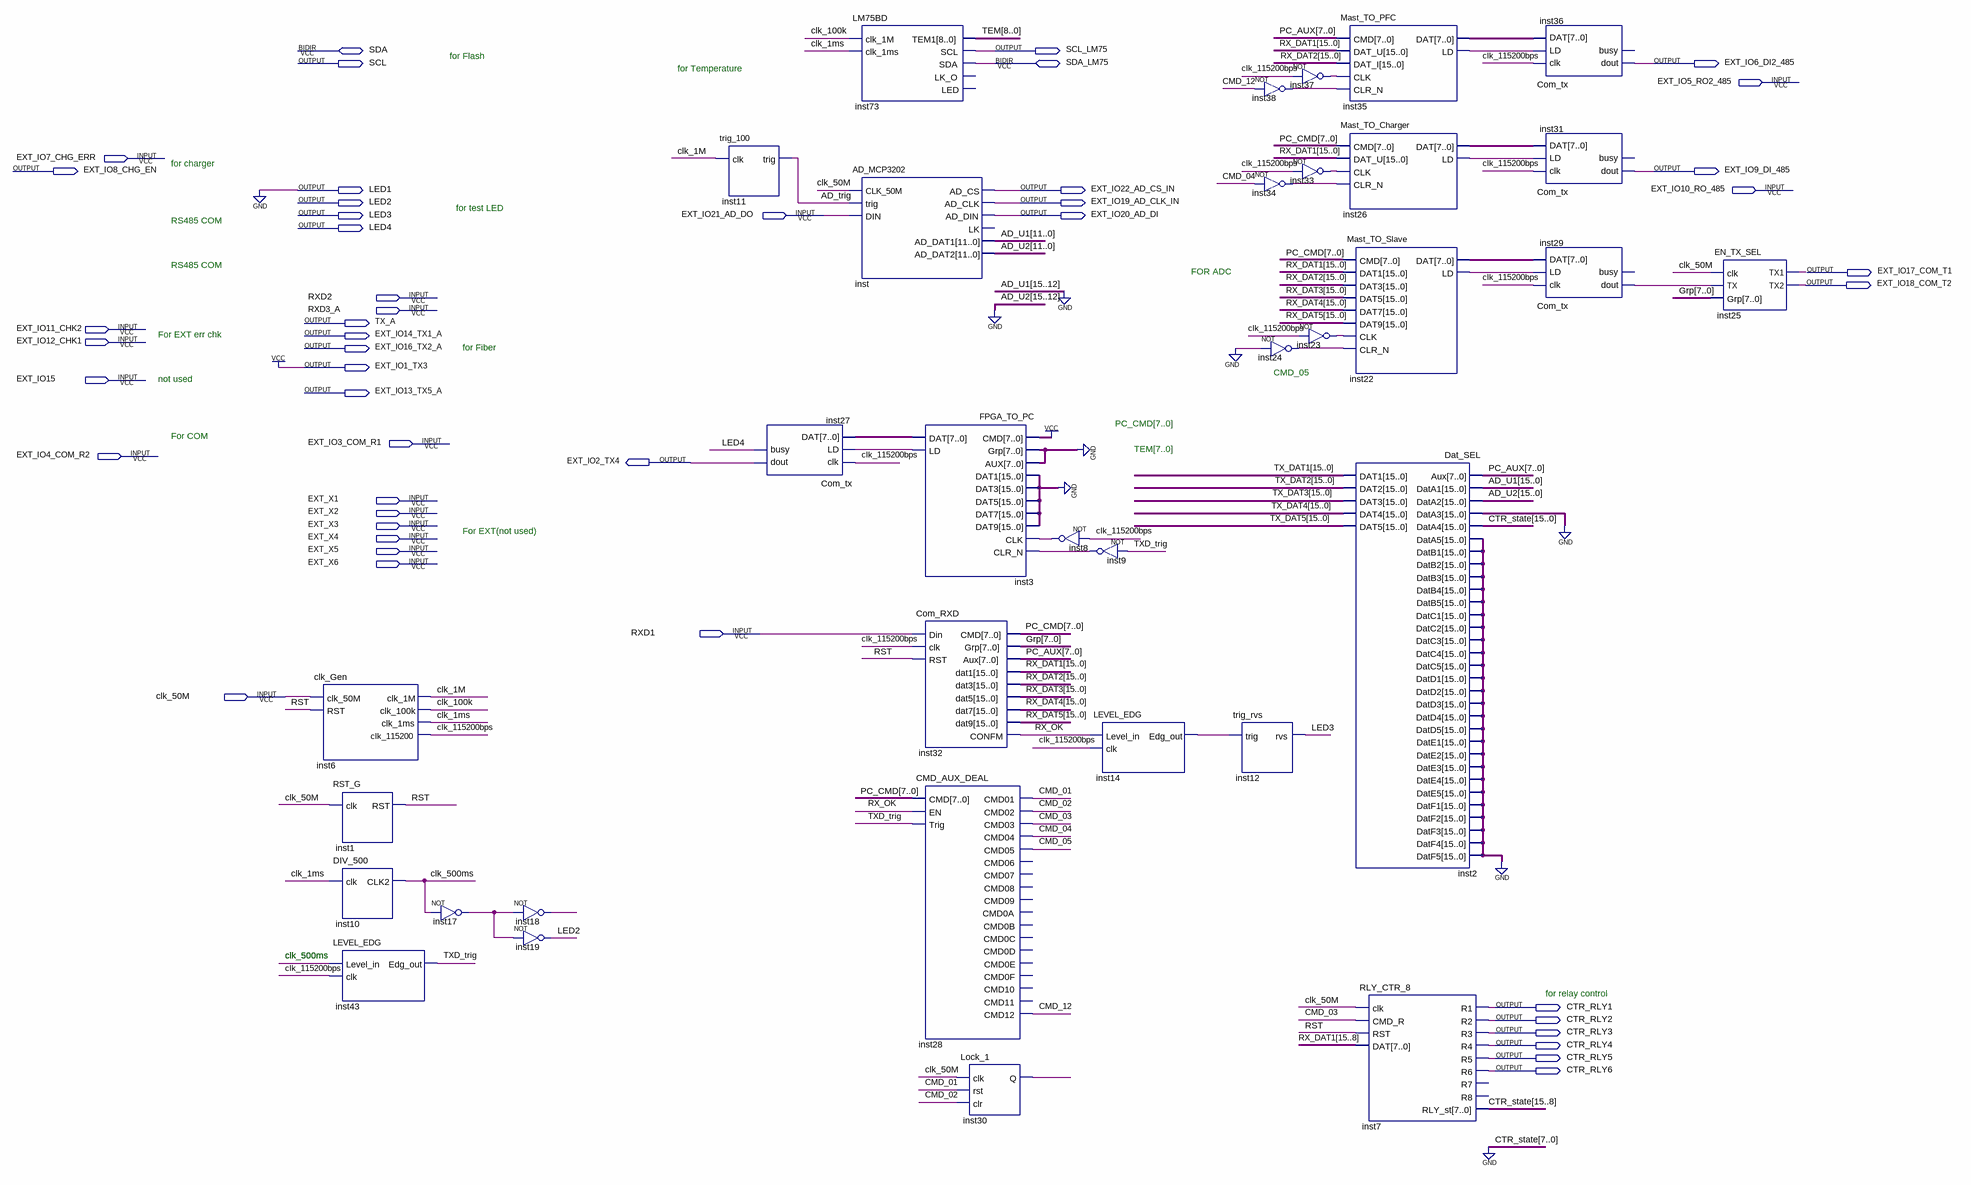
[diagram p0: schematic sheet]
// Quartus schematic TOP2.bdf as structural Verilog: 34 symbols, 47 pins
module TOP2 (
  input  EXT_IO5_RO2_485,
  input  EXT_IO7_CHG_ERR,
  input  EXT_IO10_RO_485,
  input  EXT_IO21_AD_DO,
  input  RXD2,
  input  RXD3_A,
  input  EXT_IO11_CHK2,
  input  EXT_IO12_CHK1,
  input  EXT_IO15,
  input  EXT_IO3_COM_R1,
  input  EXT_IO4_COM_R2,
  input  EXT_X1,
  input  EXT_X2,
  input  EXT_X3,
  input  EXT_X4,
  input  EXT_X5,
  input  EXT_X6,
  input  RXD1,
  input  clk_50M,
  inout  SDA,
  inout  SDA_LM75,
  output SCL_LM75,
  output SCL,
  output EXT_IO6_DI2_485,
  output EXT_IO8_CHG_EN,
  output EXT_IO9_DI_485,
  output LED1,
  output EXT_IO22_AD_CS_IN,
  output LED2,
  output EXT_IO19_AD_CLK_IN,
  output LED3,
  output EXT_IO20_AD_DI,
  output LED4,
  output EXT_IO17_COM_T1,
  output EXT_IO18_COM_T2,
  output TX_A,
  output EXT_IO14_TX1_A,
  output EXT_IO16_TX2_A,
  output EXT_IO1_TX3,
  output EXT_IO13_TX5_A,
  output EXT_IO2_TX4,
  output CTR_RLY1,
  output CTR_RLY2,
  output CTR_RLY3,
  output CTR_RLY4,
  output CTR_RLY5,
  output CTR_RLY6
);

  wire AD_trig, clk_1M, clk_1ms, clk_100k, clk_500ms, clk_115200bps, CMD_01, CMD_02, CMD_03, CMD_04, CMD_05,
       CMD_12, inst3_ld, inst8_out, inst9_out, inst14_edg_out, inst17_out, inst18_out, inst22_ld, inst23_out,
       inst24_out, inst26_ld, inst29_dout, inst30_q, inst33_out, inst34_out, inst35_ld, inst37_out,
       inst38_out, RST, RX_OK, TXD_trig;
  wire [7:0] Grp, inst3_dat, inst22_dat, inst26_dat, inst35_dat, PC_AUX, PC_CMD;
  wire [8:0] TEM;
  wire [11:0] AD_U1, AD_U2;
  wire [15:0] RX_DAT1, RX_DAT2, RX_DAT3, RX_DAT4, RX_DAT5, TX_DAT1, TX_DAT2, TX_DAT3, TX_DAT4, TX_DAT5;
  wire [15:8] CTR_state;

  clk_Gen inst6 (
    .clk_50M(clk_50M), .RST(RST), .clk_1M(clk_1M), .clk_100k(clk_100k), .clk_1ms(clk_1ms),
    .clk_115200(clk_115200bps));
  RST_G inst1 (.clk(clk_50M), .RST(RST));
  DIV_500 inst10 (.clk(clk_1ms), .CLK2(clk_500ms));
  LEVEL_EDG inst43 (.Level_in(clk_500ms), .clk(clk_115200bps), .Edg_out(TXD_trig));
  not inst17 (inst17_out, clk_500ms);
  not inst18 (inst18_out, inst17_out);
  not inst19 (LED2, inst17_out);
  trig_100 inst11 (.clk(clk_1M), .trig(AD_trig));
  Com_tx inst27 (.clk(clk_115200bps), .LD(inst3_ld), .DAT(inst3_dat), .dout(EXT_IO2_TX4), .busy(LED4));
  LM75BD inst73 (.clk_1M(clk_100k), .clk_1ms(clk_1ms), .TEM1(TEM), .SCL(SCL_LM75), .SDA(SDA_LM75));  // open: LK_O, LED
  AD_MCP3202 inst (
    .CLK_50M(clk_50M), .trig(AD_trig), .DIN(EXT_IO21_AD_DO), .AD_CS(EXT_IO22_AD_CS_IN),
    .AD_CLK(EXT_IO19_AD_CLK_IN), .AD_DIN(EXT_IO20_AD_DI), .AD_DAT1(AD_U1), .AD_DAT2(AD_U2));  // open: LK
  FPGA_TO_PC inst3 (
    .CMD({8{1'b1}}), .Grp({8{1'b0}}), .AUX({8{1'b0}}), .DAT1({16{1'b0}}), .DAT3({16{1'b0}}),
    .DAT5({16{1'b0}}), .DAT7({16{1'b0}}), .DAT9({16{1'b0}}), .CLK(inst8_out), .CLR_N(inst9_out),
    .DAT(inst3_dat), .LD(inst3_ld));
  Com_RXD inst32 (
    .Din(RXD1), .clk(clk_115200bps), .RST(RST), .CMD(PC_CMD), .Grp(Grp), .Aux(PC_AUX), .dat1(RX_DAT1),
    .dat3(RX_DAT2), .dat5(RX_DAT3), .dat7(RX_DAT4), .dat9(RX_DAT5), .CONFM(RX_OK));
  CMD_AUX_DEAL inst28 (
    .CMD(PC_CMD), .EN(RX_OK), .Trig(TXD_trig), .CMD01(CMD_01), .CMD02(CMD_02), .CMD03(CMD_03),
    .CMD04(CMD_04), .CMD05(CMD_05), .CMD12(CMD_12));  // open: CMD06, CMD07, CMD08, CMD09, CMD0A, CMD0B, CMD0C, CMD0D, CMD0E, CMD0F, CMD10, CMD11
  Lock_1 inst30 (.clk(clk_50M), .rst(CMD_01), .clr(CMD_02), .Q(inst30_q));
  not inst8 (inst8_out, clk_115200bps);
  not inst9 (inst9_out, TXD_trig);
  LEVEL_EDG inst14 (.Level_in(RX_OK), .clk(clk_115200bps), .Edg_out(inst14_edg_out));
  not inst38 (inst38_out, CMD_12);
  not inst34 (inst34_out, CMD_04);
  trig_rvs inst12 (.trig(inst14_edg_out), .rvs(LED3));
  not inst37 (inst37_out, clk_115200bps);
  not inst33 (inst33_out, clk_115200bps);
  not inst23 (inst23_out, clk_115200bps);
  not inst24 (inst24_out, 1'b0);
  Mast_TO_PFC inst35 (
    .CMD(PC_AUX), .DAT_U(RX_DAT1), .DAT_I(RX_DAT2), .CLK(inst37_out), .CLR_N(inst38_out), .DAT(inst35_dat),
    .LD(inst35_ld));
  Mast_TO_Charger inst26 (
    .CMD(PC_CMD), .DAT_U(RX_DAT1), .CLK(inst33_out), .CLR_N(inst34_out), .DAT(inst26_dat), .LD(inst26_ld));
  Mast_TO_Slave inst22 (
    .CMD(PC_CMD), .DAT1(RX_DAT1), .DAT3(RX_DAT2), .DAT5(RX_DAT3), .DAT7(RX_DAT4), .DAT9(RX_DAT5),
    .CLK(inst23_out), .CLR_N(inst24_out), .DAT(inst22_dat), .LD(inst22_ld));
  Dat_SEL inst2 (
    .Aux(PC_AUX), .DatA1({4'b0000, AD_U1}), .DatA2({4'b0000, AD_U2}), .DatA3({16{1'b0}}),
    .DatA4({CTR_state, {8{1'b0}}}), .DatA5({16{1'b0}}), .DatB1({16{1'b0}}), .DatB2({16{1'b0}}),
    .DatB3({16{1'b0}}), .DatB4({16{1'b0}}), .DatB5({16{1'b0}}), .DatC1({16{1'b0}}), .DatC2({16{1'b0}}),
    .DatC3({16{1'b0}}), .DatC4({16{1'b0}}), .DatC5({16{1'b0}}), .DatD1({16{1'b0}}), .DatD2({16{1'b0}}),
    .DatD3({16{1'b0}}), .DatD4({16{1'b0}}), .DatD5({16{1'b0}}), .DatE1({16{1'b0}}), .DatE2({16{1'b0}}),
    .DatE3({16{1'b0}}), .DatE4({16{1'b0}}), .DatE5({16{1'b0}}), .DatF1({16{1'b0}}), .DatF2({16{1'b0}}),
    .DatF3({16{1'b0}}), .DatF4({16{1'b0}}), .DatF5({16{1'b0}}), .DAT1(TX_DAT1), .DAT2(TX_DAT2),
    .DAT3(TX_DAT3), .DAT4(TX_DAT4), .DAT5(TX_DAT5));
  RLY_CTR_8 inst7 (
    .clk(clk_50M), .CMD_R(CMD_03), .RST(RST), .DAT(RX_DAT1[15:8]), .R1(CTR_RLY1), .R2(CTR_RLY2),
    .R3(CTR_RLY3), .R4(CTR_RLY4), .R5(CTR_RLY5), .R6(CTR_RLY6), .RLY_st(CTR_state));  // open: R7, R8
  Com_tx inst36 (.clk(clk_115200bps), .LD(inst35_ld), .DAT(inst35_dat), .dout(EXT_IO6_DI2_485));  // open: busy
  Com_tx inst31 (.clk(clk_115200bps), .LD(inst26_ld), .DAT(inst26_dat), .dout(EXT_IO9_DI_485));  // open: busy
  Com_tx inst29 (.clk(clk_115200bps), .LD(inst22_ld), .DAT(inst22_dat), .dout(inst29_dout));  // open: busy
  EN_TX_SEL inst25 (.clk(clk_50M), .TX(inst29_dout), .Grp(Grp), .TX1(EXT_IO17_COM_T1), .TX2(EXT_IO18_COM_T2));

  assign EXT_IO1_TX3 = 1'b1;
  assign LED1 = 1'b0;

  // Notes on the sheet:
  //   for Flash
  //   for Temperature
  //   for charger
  //   for test LED
  //   RS485 COM
  //   RS485 COM
  //   FOR ADC
  //   For EXT err chk
  //   for Fiber
  //   CMD_05
  //   not used
  //   PC_CMD[7..0]
  //   For COM
  //   TEM[7..0]
  //   For EXT(not used)
  //   clk_500ms
  //   for relay control
endmodule
